# Altium schematic sheet STM8S003F3P6_RF433_RELAY_220V_LEARN_CODE.SchDoc
size A
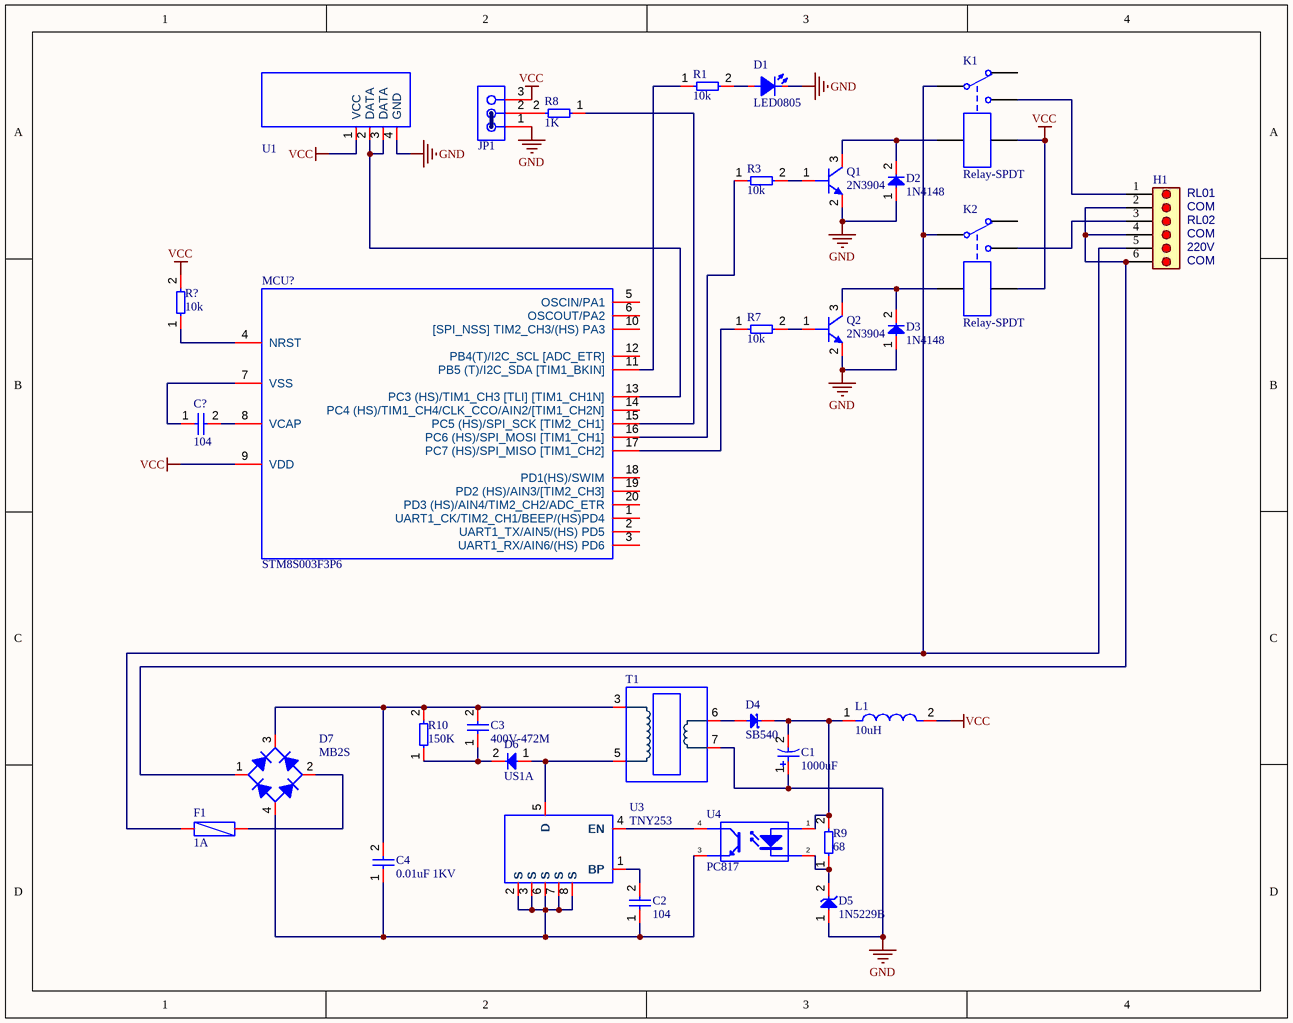
[diagram p0: STM8S003F3P6_RF433_RELAY_220V_LEARN_CODE.SchDoc]

## Parts
C1  1000uF  [CAP_RAD_4mm]
C2  104  [C0805]
C3  400V-472M  [C0805]
C4  0.01uF 1KV  [C1812]
C?  104  [C0805]
D1  LED0805  [L0805RED]
D2  1N4148  [SOD-80]
D3  1N4148  [SOD-80]
D4  SB540  [DO-214AC(SMA)]
D5  1N5229B  [DO-213AB]
D6  US1A  [DO-214AC(SMA)]
D7  MB2S  [TO-269AA]
F1  1A  [FUSE1812]
H1  Header Big 6  [HEADER BIG 6]  (value not drawn)
JP1  Header 3x1 TH Pitch 2.54mm  [Header 3x1 TH Pitch 2.54mm]  (value not drawn)
K1  Relay-SPDT  [RELAY 5A]
K2  Relay-SPDT  [RELAY 5A]
L1  10uH  [INDUCTOR_1206]
MCU?  STM8S003F3P6  [TQFP32_0.8_07]
Q1  2N3904  [SOT23-3]
Q2  2N3904  [SOT23-3]
R1  10k  [R0805]
R3  10k  [R0805]
R7  10k  [R0805]
R8  1K  [R0805]
R9  68  [R0805]
R10  150K  [R0805]
R?  10k  [R0805]
T1  TRANSFORMER_EE16A  [TRANSFORMER_EE16A]  (value not drawn)
U1  RF433_315_RECEVICE  [RF433_315_RECEVICE]  (value not drawn)
U3  TNY253  [SOIC08_1.27_6.0]
U4  PC817  [DIP4]

## Nets
GND: C1.1 D1.2(K) D2.1 D3.1 D5.1 JP1.1 Q1.2(E) Q2.2(E) T1.7 U1.4(GND)
VCC: JP1.3 K1.3 K2.3 L1.2 MCU?.9(VDD) R?.2 U1.1(VCC)
NetC1_2: C1.2 D4.2(K) L1.1 R9.2 U4.1(A)
NetC2_1: C2.1 C4.1 D7.4 U3.2(S) U3.3(S) U3.6(S) U3.7(S) U3.8(S) U4.3(E)
NetC2_2: C2.2 U3.1(BP)
NetC3_1: C3.1 D6.2 R10.1
NetC3_2: C3.2 C4.2 D7.3 R10.2 T1.3
NetC?_1: C?.1 MCU?.7(VSS)
NetC?_2: C?.2 MCU?.8(VCAP)
NetD1_1: D1.1(A) R1.2
NetD2_2: D2.2 K1.1 Q1.3(C)
NetD3_2: D3.2 K2.1 Q2.3(C)
NetD4_1: D4.1(A) T1.6
NetD5_2: D5.2 R9.1 U4.2(K)
NetD6_1: D6.1 T1.5 U3.5(D)
NetD7_1: D7.1 H1.2 H1.4 H1.6
NetD7_2: D7.2 F1.2
NetF1_1: F1.1 H1.5 K1.2 K2.2
NetH1_1: H1.1 K1.5
NetH1_3: H1.3 K2.5
NetJP1_2: JP1.2 R8.2
NetMCU?_4: MCU?.4(NRST) R?.1
NetMCU?_11: MCU?.11(PB5_(T)/I2C_SDA_[TIM1_BKIN]) R1.1
NetMCU?_13: MCU?.13(PC3_(HS)/TIM1_CH3_[TLI]_[TIM1_CH1N]) U1.2(DATA) U1.3(DATA)
NetMCU?_15: MCU?.15(PC5_(HS)/SPI_SCK_[TIM2_CH1]) R8.1
NetMCU?_16: MCU?.16(PC6_(HS)/SPI_MOSI_[TIM1_CH1]) R3.1
NetMCU?_17: MCU?.17(PC7_(HS)/SPI_MISO_[TIM1_CH2]) R7.1
NetQ1_1: Q1.1(B) R3.2
NetQ2_1: Q2.1(B) R7.2
NetU3_4: U3.4(EN) U4.4(C)

Not connected (* = marked no-connect by the designer): K1 4; K2 4; MCU? 1(UART1_CK/TIM2_CH1/BEEP/(HS)PD4) 2(UART1_TX/AIN5/(HS)_PD5) 3(UART1_RX/AIN6/(HS)_PD6) 5(OSCIN/PA1) 6(OSCOUT/PA2) 10([SPI_NSS]_TIM2_CH3/(HS)_PA3) 12(PB4(T)/I2C_SCL_[ADC_ETR]) 14(PC4_(HS)/TIM1_CH4/CLK_CCO/AIN2/[TIM1_CH2N]) 18(PD1(HS)/SWIM) 19(PD2_(HS)/AIN3/[TIM2_CH3]) 20(PD3_(HS)/AIN4/TIM2_CH2/ADC_ETR)

## Notes on the sheet
- (near H1) COM
- (near H1) RL02
- (near H1) RL01
- (near H1) 220V

## Library data of the parts
C1 = Capacitor(Radian)
C2 C3 C? = C0805
C4 = Capacitors(SMD)
D2 D3 = 1N4148 (SOD-80)
D4 = Diode Schottky
D5 = Diode Zener
D6 = US1A-US1M
D7 = Diode MB2S
F1 = Fuse
L1 = Inductor
Q1 Q2 = 2N3904 (SOT-23)
R1 R3 R7-R10 R? = Resistor SMD
U1 = RF433_315
K1 K2 = Relay-SPDT: Published: 24-Mar-1999; LatestRevisionDate: 17-Jul-2002; LatestRevisionNote: Re-released for DXP Platform.; PackageReference: MODULE5B; Publisher: Altium Limited